# Altium schematic sheet USB OTG.SchDoc
size 180 x 134 mm
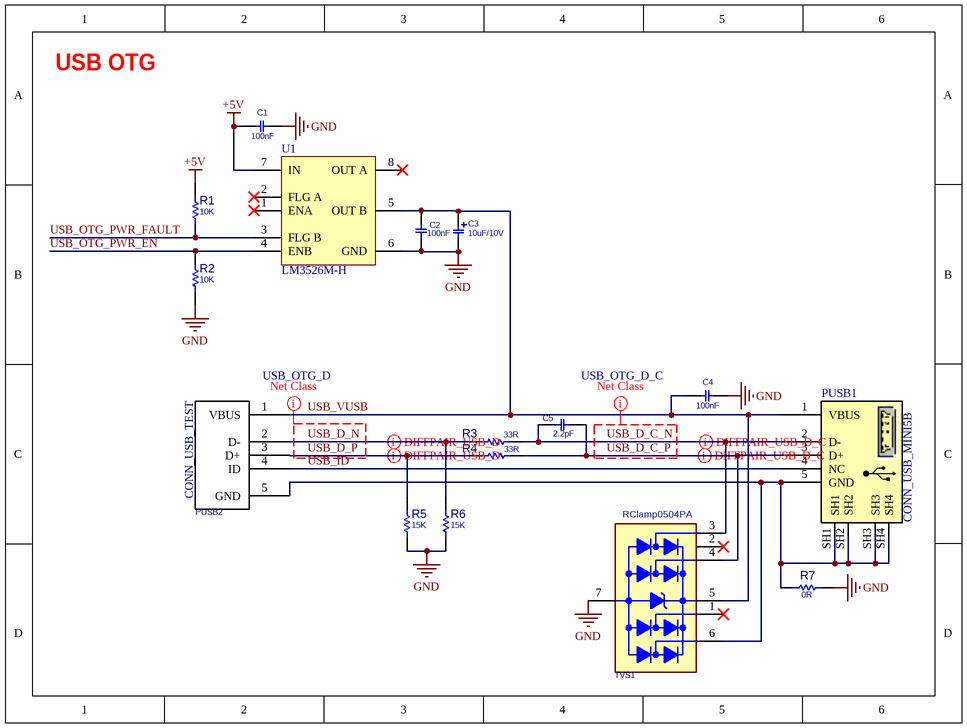
[diagram p0: USB OTG.SchDoc]

## Parts
C1  100nF  [C0603S]
C2  100nF  [C0603S]
C3  10uF/10V  [C_TN_A]
C4  100nF  [C0603S]
C5  2.2pF  [C0603S]
PUSB1  CONN_USB_MINI5B  [USB_MINI_B5_SMD]
PUSB2  CONN_USB_TEST  [USBTEST]
R1  10K  [R0603S]
R2  10K  [R0603S]
R3  33R  [R0603S]
R4  33R  [R0603S]
R5  15K  [R0603S]
R6  15K  [R0603S]
R7  0R  [R0603S]
TVS1  RClamp0504PA  [SLP1616P6]  (value not drawn)
U1  LM3526M-H  [SO-8]

## Nets
+5V: C1.1 R1.1 U1.7(IN)
GND: C1.2 C2.1 C3.2 C4.2 R2.2 R5.2 R6.2 R7.1 TVS1.7 U1.6(GND)
USB_D_C_N: C5.1 PUSB1.2(D-) R3.2 TVS1.3
USB_D_C_P: C5.2 PUSB1.3(D+) R4.2 TVS1.4
USB_D_N: PUSB2.2(D-) R3.1 R6.1
USB_D_P: PUSB2.3(D+) R4.1 R5.1
USB_ID: PUSB1.4(NC) PUSB2.4(ID)
USB_OTG_PWR_EN: R2.1 U1.4(ENB)
USB_OTG_PWR_FAULT: R1.2 U1.3(FLG_B)
USB_VUSB: C2.2 C3.1 C4.1 PUSB1.1(VBUS) PUSB2.1(VBUS) TVS1.5 U1.5(OUT_B)
NetPUSB1_5: PUSB1.5(GND) PUSB1.SH1 PUSB1.SH2 PUSB1.SH3 PUSB1.SH4 PUSB2.5(GND) R7.2 TVS1.6

Not connected (* = marked no-connect by the designer): TVS1 1* 2*; U1 1(ENA)* 2(FLG_A)* 8(OUT_A)*

## Layout directives
net class USB_OTG_D_C: USB_D_C_N, USB_D_C_P
net class USB_OTG_D: USB_D_N, USB_D_P
differential pair: USB_D_C_N, USB_D_C_P, USB_D_N, USB_D_P

## Notes on the sheet
- USB OTG
- (near PUSB2) USB_OTG_D
- USB_OTG_D_C

## Library data of the parts
C1 C2 C4 C5 = CAP_SMD_MLCC: CAP, MLCC, 1nF, 50V, C0G, 10%, 0402; MANF_P#: MANF_PART#; MANF: Murata; PARAM: 50V; PRICE: 100= 1$; DESC: CAP, MLCC, 1nF, 50V, C0G, 10%, 0402; PARAM2: C0G, 10%; ASSEMBLY: ASSEMBLY
  C1 C2 C4: VALUE: 100nF
  C5: VALUE: 2.2pF
C3 = CAP_SMD_TAN: CAP, SMD, TAN; PARAM: 10V; VALUE: 10uF/10V
PUSB1 = CONN_USB_MINI5B_SMD: CONN, USB, MINI 5 B, R/A, SMD; MANF_P#: UX60-MB-5ST; MANF: Hirose; MANF_P#2: 67503-1020 MOLEX; VALUE: CONN_USB_MINI5B
PUSB2 = CONN_USB_TEST: CONN, USB, TEST; VALUE: CONN_USB_TEST
R1-R7 = RES_SMD: RESISTOR, SMD; MANF_P#: RK73H1ETTP4701F; MANF: KOA SPEER; PARAM: 0.063W; DESC: DESCRIPTION; DIST#: MOUSER; PARAM2: 1%; ASSEMBLY: ASSEMBLY; PRICE: 100= 0.5$
  R1 R2: VALUE: 10K
  R3 R4: VALUE: 33R
  R5 R6: VALUE: 15K
  R7: VALUE: 0R
TVS1 = DIODE_SMD_TVS_ARRAY_RClamp0504PA: DIODE, SMD, TVS ARRAY; VALUE: RClamp0504PA
U1 = LM3526M-H: Dual Port USB Power Switch and Over-Current Protection, 8-pin Narrow SOIC; PartNumber: LM3526M-L; Manufacturer: National Semiconductor; PackageTopMarking: NSZXTT*3526*M-L; PowerWise: N; CompType: MiscPower; Published: 4-Dec-2008; DatasheetVersion: Mar-2005; PackageVersion: revM, May-2009; PackageReference: M08A; Publisher: Altium Limited; PackageDescription: SOIC Narrow, 4.9 x 3.9 x 1.45mm, 8 Lead, 1.27mm Pitch; RoHS: N; PinCount: 8; Code_JEDEC: MS-012-AA; Code_IPC: SOIC127P600-8; ComponentLink1Description: LM3526 Datasheet; ComponentLink1URL: http://www.national.com/ds/LM/LM3526.pdf; ComponentLink2Description: LM3526 Web Page; ComponentLink2URL: http://www.national.com/pf/LM/LM3526.html; ComponentLink3Description: M08A Package Page; ComponentLink3URL: http://www.national.com/packaging/folders/m08a.html